# Altium schematic sheet 电感运放.SchDoc
size A4
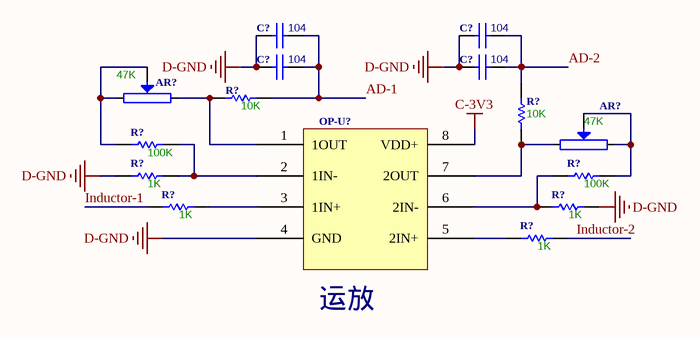
[diagram p0: 电感运放.SchDoc]

## Parts
(Parts that share a designator on the sheet are numbered #1, #2 ... from top to bottom, then left to right.)
AR?#1  VR  [VR3296-1]  (value not drawn)
AR?#2  VR  [VR3296-1]  (value not drawn)
C?#1  104  [CAPC1608[0603]]
C?#2  104  [CAPC1608[0603]]
C?#3  104  [CAPC1608[0603]]
C?#4  104  [CAPC1608[0603]]
OP-U?  TLV2462  [SOP8]  (value not drawn)
R?#1  value 10K  [RESC1608[0603]]  (hidden comment: Res1)
R?#2  value 10K  [RESC1608[0603]]  (hidden comment: Res1)
R?#3  value 100K  [RESC1608[0603]]  (hidden comment: Res1)
R?#4  value 100K  [RESC1608[0603]]  (hidden comment: Res1)
R?#5  value 1K  [RESC1608[0603]]  (hidden comment: Res1)
R?#6  value 1K  [RESC1608[0603]]  (hidden comment: Res1)
R?#7  value 1K  [RESC1608[0603]]  (hidden comment: Res1)
R?#8  value 1K  [RESC1608[0603]]  (hidden comment: Res1)

## Nets
C-3V3: OP-U?.8(VDD+)
D-GND: C?#1.2 C?#2.2 C?#3.2 C?#4.2 OP-U?.4(GND) R?#5.2 R?#7.1
AD-1: C?#1.1 C?#3.1 R?#2.1
AD-2: C?#2.1 C?#4.1 R?#1.1
Inductor-1: R?#6.2
Inductor-2: R?#8.1
NetAR?#1_1: AR?#1.1 AR?#1.3 R?#3.1
NetAR?#1_2: AR?#1.2 OP-U?.1(1OUT) R?#2.2
NetAR?#2_1: AR?#2.1 OP-U?.7(2OUT) R?#1.2
NetAR?#2_2: AR?#2.2 AR?#2.3 R?#4.2
NetOP-U?_2: OP-U?.2(1IN-) R?#3.2 R?#5.1
NetOP-U?_3: OP-U?.3(1IN+) R?#6.1
NetOP-U?_5: OP-U?.5(2IN+) R?#8.2
NetOP-U?_6: OP-U?.6(2IN-) R?#4.1 R?#7.2

## Notes on the sheet
- (near OP-U?) 运放
- (in symbol VR) 47K

## Library data of the parts
C?#1-C?#4 = Cap: Capacitor; Published: 8-Jun-2000; LatestRevisionDate: 17-Jul-2002; LatestRevisionNote: Re-released for DXP Platform.; PackageReference: RAD-0.3; Publisher: Altium Limited; PackageDescription: Radial Cap, Thru-Hole; 2 Leads; 0.3 in Pin Spacing; Value: 104
R?#1-R?#8 = Res1: Resistor; Published: 8-Jun-2000; LatestRevisionDate: 17-Jul-2002; LatestRevisionNote: Re-released for DXP Platform.; PackageReference: AXIAL-0.3; Publisher: Altium Limited; PackageDescription: Axial Device, Thru-Hole; 2 Leads; 0.3 in Pin Spacing